# EAGLE design programmer (EAGLE 9.2.2)
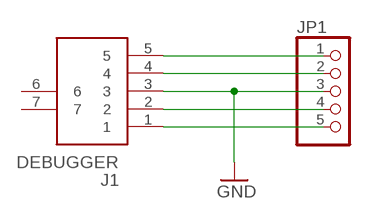
[diagram p0: schematic, sheet 1]

## Parts
J1  DEBUGGER  [0512810594]
JP1  PINHD-1X5  [1X05]

## Nets
GND: J1.3 JP1.3
N$1: J1.5 JP1.1
N$2: J1.4 JP1.2
N$4: J1.2 JP1.4
N$5: J1.1 JP1.5
Unconnected: J1.6 J1.7

## Library data of the parts
J1 = FPC_0512810594:DEBUGGER: CONN FFC FPC 5POS 0.50MM R/A Source: Datasheet <http://www.molex.com/webdocs/datasheets/pdf/en-us//0512810594_FFC_FPC_CONNECTORS.pdf>; DESCRIPTION: CONN FFC FPC 5POS 0.50MM R/A; LINK: https://www.digikey.com/product-detail/en/molex-llc/0512810594/WM12846CT-ND/4176653; MANUFACTURER_NAME: Molex; MANUFACTURER_PART_NUM: 0512810594
JP1 = pinhead:PINHD-1X5: PIN HEADER

## Board
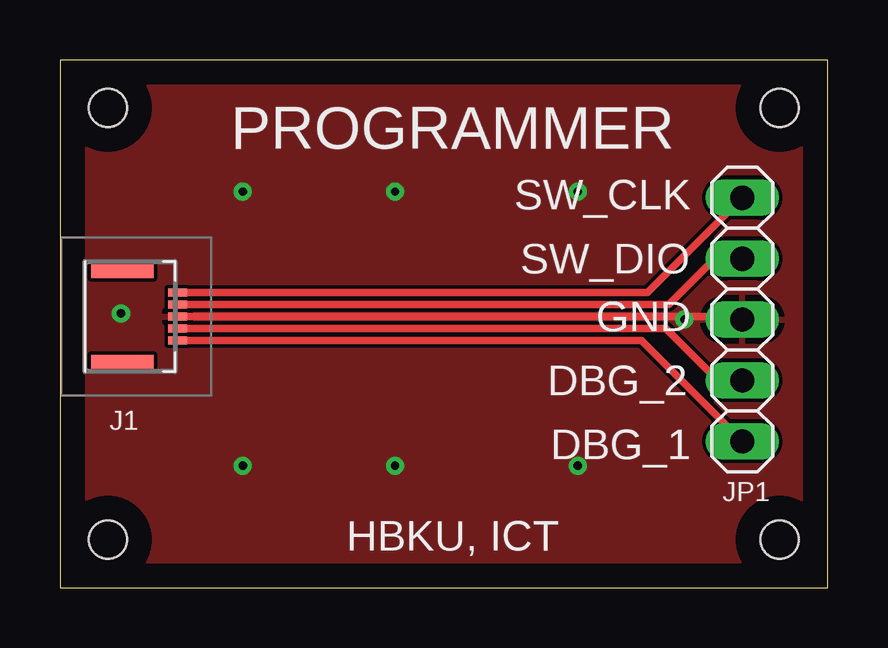
[diagram p1: board, top side]
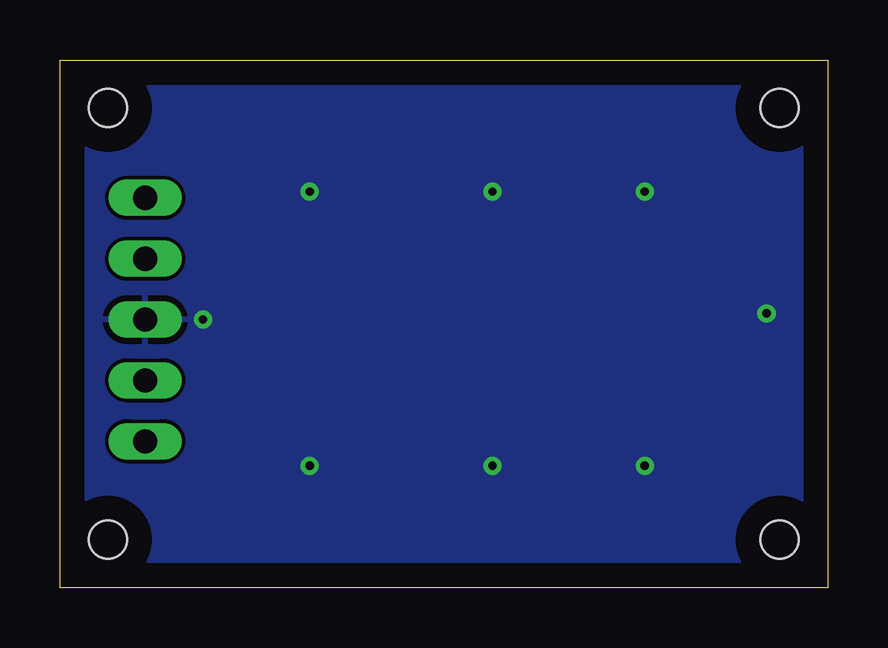
[diagram p2: board, bottom side, seen from below]

Size 32 x 22 mm. Coordinates in mm from the lower left corner, seen from the top.
Outline: 0,0 32,0 32,22 0,22 0,0
Copper layers (1*16): Top 0.035mm / dielectric 1.5mm / Bottom 0.035mm
Design rules "default *": minimum track width 6mil, minimum drill 0.35mm, track to track 6mil, track to pad 6mil, pad to pad 6mil, via to via 6mil, smd to smd 6mil, copper to edge 40mil, drill to drill 6mil, minimum pad ring 10mil, minimum via ring 8mil, stop-mask expansion 4mil, vias tented up to drill 50mm, thermal gap 10mil
Holes 1.6 mm at 2,20 30,20 30,2 2,2

### Footprints (pad centres in the part's own frame; a part is rotated, then mirrored left to right if it is on the bottom)
0512810594 = smd 0.35 x 0.8: 1 -1,1.725; 2 -0.5,1.725; 3 0,1.725; 4 0.5,1.725; 5 1,1.725 | smd 0.6 x 2.6: 6 -1.9,-0.575; 7 1.9,-0.575
1X05 = drill 1.016 long: 1 -5.08,0; 2 -2.54,0; 3 0,0; 4 2.54,0; 5 5.08,0

### Placement (x,y rotation side)
J1  3.17,11.3 270 top
JP1  28.45,11.18 90 top

### Tracks (layer width: path | path; a pad name or v marks a point on that pad's centre or on a via)
GND  (via drill 0.35)
  Top 0.305: J1.3 28.32,11.3 JP1.3
  other vias: 7.62,16.51 2.54,11.43 7.62,5.08 13.97,5.08 13.97,16.51 21.59,16.51 21.59,5.08 26.04,11.18
  pour Top: 0.25,21.72 31.75,21.72 31.75,0.25 0.25,0.25
  pour Bottom: 0.64,21.34 31.37,21.34 31.37,0.64 0.64,0.64
N$1
  Top 0.305: J1.5 24.24,10.3 JP1.1
N$2
  Top 0.305: J1.4 25.27,10.8 27.43,8.64 JP1.2
N$4
  Top 0.305: J1.2 25.39,11.8 27.3,13.72 JP1.4
N$5
  Top 0.305: JP1.5 24.5,12.3 J1.1

### Text on the board
tPlace: PROGRAMMER | SW_CLK | SW_DIO | GND | DBG_2 | DBG_1 | HBKU, ICT